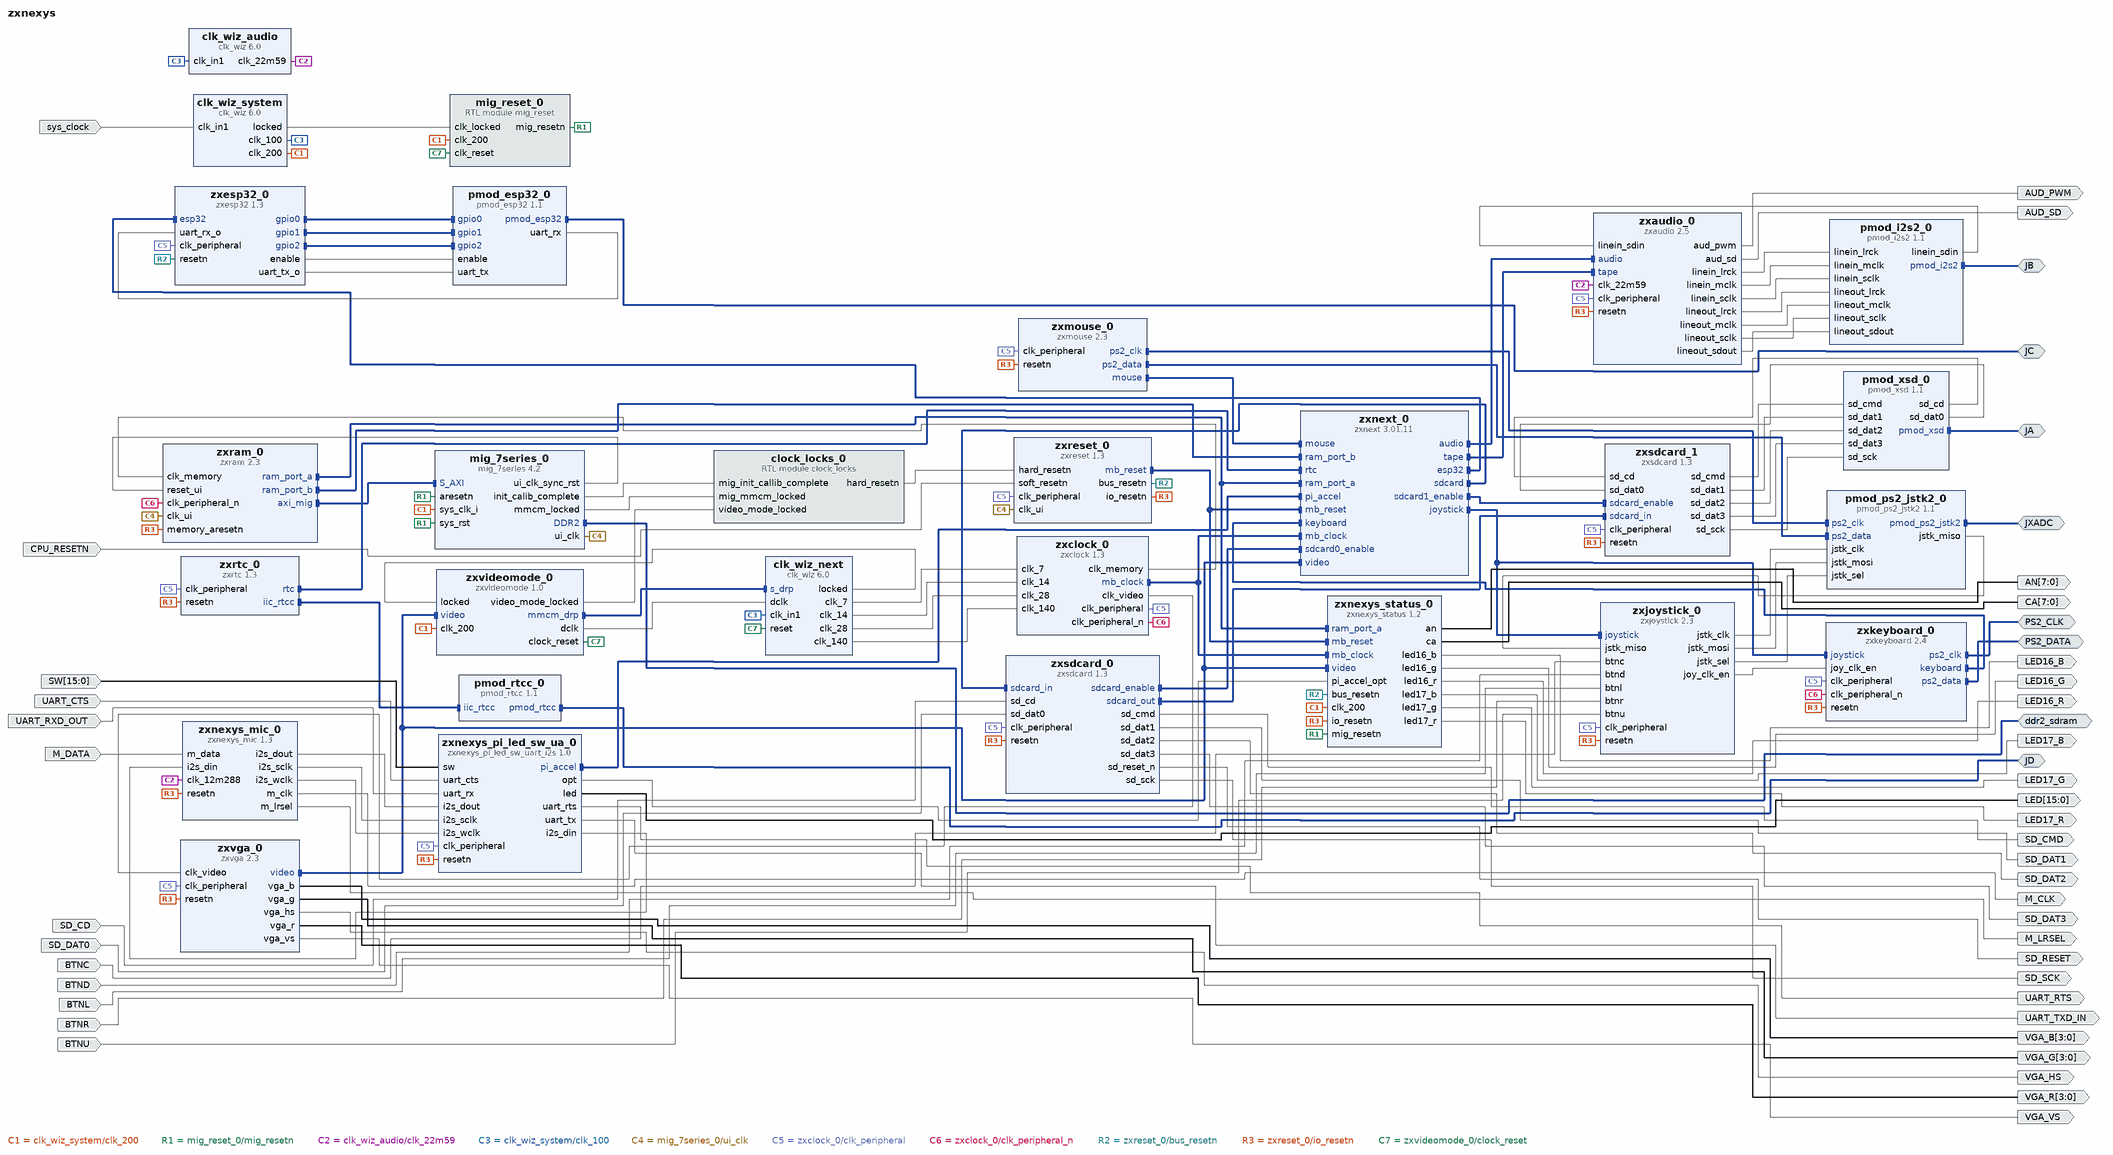
[diagram p0: block diagram of the top level]
# Vivado block design zxnexys, xc7a100tcsg324-1, Vivado 2021.2.1
create_bd_design zxnexys

create_bd_intf_port -mode Master -vlnv xilinx.com:interface:ddrx_rtl:1.0 ddr2_sdram
create_bd_intf_port -mode Master -vlnv digilentinc.com:interface:pmod_rtl:1.0 JC
create_bd_intf_port -mode Master -vlnv digilentinc.com:interface:pmod_rtl:1.0 JXADC
create_bd_intf_port -mode Master -vlnv digilentinc.com:interface:pmod_rtl:1.0 JD
create_bd_intf_port -mode Master -vlnv digilentinc.com:interface:pmod_rtl:1.0 JB
create_bd_intf_port -mode Master -vlnv digilentinc.com:interface:pmod_rtl:1.0 JA
create_bd_intf_port -mode Master -vlnv xilinx.com:interface:gpio_rtl:1.0 PS2_CLK
create_bd_intf_port -mode Master -vlnv xilinx.com:interface:gpio_rtl:1.0 PS2_DATA
create_bd_port -dir I -type clk sys_clock
set_property -dict {CONFIG.FREQ_HZ 100000000 CONFIG.PHASE 0.0} [get_bd_ports sys_clock]
create_bd_port -dir I -type rst CPU_RESETN
create_bd_port -dir I M_DATA
create_bd_port -dir O -type clk M_CLK
create_bd_port -dir O M_LRSEL
create_bd_port -dir O -from 7 -to 0 AN
create_bd_port -dir O -from 7 -to 0 CA
create_bd_port -dir O AUD_PWM
create_bd_port -dir O AUD_SD
create_bd_port -dir O -from 3 -to 0 VGA_B
create_bd_port -dir O -from 3 -to 0 VGA_G
create_bd_port -dir O -from 3 -to 0 VGA_R
create_bd_port -dir O VGA_HS
create_bd_port -dir O VGA_VS
create_bd_port -dir I SD_CD
create_bd_port -dir I SD_DAT0
create_bd_port -dir I BTNC
create_bd_port -dir I BTND
create_bd_port -dir I BTNL
create_bd_port -dir I BTNR
create_bd_port -dir I BTNU
create_bd_port -dir O SD_CMD
create_bd_port -dir O SD_DAT1
create_bd_port -dir O SD_DAT2
create_bd_port -dir O SD_DAT3
create_bd_port -dir O SD_RESET
create_bd_port -dir O SD_SCK
create_bd_port -dir O -from 15 -to 0 LED
create_bd_port -dir O LED16_B
create_bd_port -dir O LED16_G
create_bd_port -dir O LED16_R
create_bd_port -dir O LED17_B
create_bd_port -dir O LED17_G
create_bd_port -dir O LED17_R
create_bd_port -dir I -from 15 -to 0 SW
create_bd_port -dir O UART_RTS
create_bd_port -dir I UART_CTS
create_bd_port -dir O UART_TXD_IN
create_bd_port -dir I UART_RXD_OUT

create_bd_cell -type ip -vlnv xilinx.com:ip:clk_wiz:6.0 clk_wiz_next
set_property -dict [list \
  CONFIG.AXI_DRP false \
  CONFIG.CLKIN1_JITTER_PS 100.0 \
  CONFIG.CLKOUT1_DRIVES BUFG \
  CONFIG.CLKOUT1_JITTER 272.789 \
  CONFIG.CLKOUT1_PHASE_ERROR 310.955 \
  CONFIG.CLKOUT1_REQUESTED_OUT_FREQ 140 \
  CONFIG.CLKOUT1_REQUESTED_PHASE 0 \
  CONFIG.CLKOUT2_DRIVES No_buffer \
  CONFIG.CLKOUT2_JITTER 365.532 \
  CONFIG.CLKOUT2_PHASE_ERROR 310.955 \
  CONFIG.CLKOUT2_REQUESTED_OUT_FREQ 28 \
  CONFIG.CLKOUT2_REQUESTED_PHASE 0 \
  CONFIG.CLKOUT2_USED true \
  CONFIG.CLKOUT3_DRIVES No_buffer \
  CONFIG.CLKOUT3_JITTER 410.498 \
  CONFIG.CLKOUT3_PHASE_ERROR 310.955 \
  CONFIG.CLKOUT3_REQUESTED_OUT_FREQ 14 \
  CONFIG.CLKOUT3_REQUESTED_PHASE 0 \
  CONFIG.CLKOUT3_USED true \
  CONFIG.CLKOUT4_DRIVES No_buffer \
  CONFIG.CLKOUT4_JITTER 459.723 \
  CONFIG.CLKOUT4_PHASE_ERROR 310.955 \
  CONFIG.CLKOUT4_REQUESTED_OUT_FREQ 7 \
  CONFIG.CLKOUT4_REQUESTED_PHASE 0 \
  CONFIG.CLKOUT4_USED true \
  CONFIG.CLKOUT5_DRIVES No_buffer \
  CONFIG.CLKOUT5_JITTER 149.337 \
  CONFIG.CLKOUT5_PHASE_ERROR 122.577 \
  CONFIG.CLKOUT5_REQUESTED_OUT_FREQ 100 \
  CONFIG.CLKOUT5_REQUESTED_PHASE 0 \
  CONFIG.CLKOUT5_USED false \
  CONFIG.CLKOUT6_DRIVES No_buffer \
  CONFIG.CLKOUT6_JITTER 149.337 \
  CONFIG.CLKOUT6_PHASE_ERROR 122.577 \
  CONFIG.CLKOUT6_REQUESTED_OUT_FREQ 100 \
  CONFIG.CLKOUT6_REQUESTED_PHASE 0 \
  CONFIG.CLKOUT6_USED false \
  CONFIG.CLKOUT7_DRIVES No_buffer \
  CONFIG.CLKOUT7_JITTER 149.337 \
  CONFIG.CLKOUT7_PHASE_ERROR 122.577 \
  CONFIG.CLKOUT7_REQUESTED_OUT_FREQ 100 \
  CONFIG.CLKOUT7_REQUESTED_PHASE 0.000 \
  CONFIG.CLKOUT7_USED false \
  CONFIG.CLK_IN1_BOARD_INTERFACE Custom \
  CONFIG.CLK_OUT1_PORT clk_140 \
  CONFIG.CLK_OUT2_PORT clk_28 \
  CONFIG.CLK_OUT3_PORT clk_14 \
  CONFIG.CLK_OUT4_PORT clk_7 \
  CONFIG.CLK_OUT5_PORT clk_out5 \
  CONFIG.CLK_OUT6_PORT clk_out6 \
  CONFIG.CLK_OUT7_PORT clk_out7 \
  CONFIG.FEEDBACK_SOURCE FDBK_AUTO \
  CONFIG.INTERFACE_SELECTION Enable_DRP \
  CONFIG.MMCM_CLKFBOUT_MULT_F 42.000 \
  CONFIG.MMCM_CLKIN1_PERIOD 10.000 \
  CONFIG.MMCM_CLKIN2_PERIOD 10.000 \
  CONFIG.MMCM_CLKOUT0_DIVIDE_F 6.000 \
  CONFIG.MMCM_CLKOUT0_PHASE 0.000 \
  CONFIG.MMCM_CLKOUT1_DIVIDE 30 \
  CONFIG.MMCM_CLKOUT1_PHASE 0.000 \
  CONFIG.MMCM_CLKOUT2_DIVIDE 60 \
  CONFIG.MMCM_CLKOUT2_PHASE 0.000 \
  CONFIG.MMCM_CLKOUT3_DIVIDE 120 \
  CONFIG.MMCM_CLKOUT4_DIVIDE 1 \
  CONFIG.MMCM_CLKOUT4_PHASE 0.000 \
  CONFIG.MMCM_CLKOUT5_DIVIDE 1 \
  CONFIG.MMCM_CLKOUT6_DIVIDE 1 \
  CONFIG.MMCM_DIVCLK_DIVIDE 5 \
  CONFIG.NUM_OUT_CLKS 4 \
  CONFIG.OVERRIDE_MMCM false \
  CONFIG.PHASE_DUTY_CONFIG false \
  CONFIG.PRIM_SOURCE Global_buffer \
  CONFIG.RESET_PORT reset \
  CONFIG.RESET_TYPE ACTIVE_HIGH \
  CONFIG.USE_BOARD_FLOW true \
  CONFIG.USE_DYN_RECONFIG true \
  CONFIG.USE_RESET true \
] [get_bd_cells clk_wiz_next]
create_bd_cell -type ip -vlnv xilinx.com:ip:mig_7series:4.2 mig_7series_0
set_property -dict [list \
  CONFIG.BOARD_MIG_PARAM ddr2_sdram \
  CONFIG.MIG_DONT_TOUCH_PARAM Custom \
  CONFIG.RESET_BOARD_INTERFACE Custom \
  CONFIG.XML_INPUT_FILE mig_b.prj \
] [get_bd_cells mig_7series_0]
create_bd_cell -type ip -vlnv specnext.com:specnext:pmod_ps2_jstk2:1.1 pmod_ps2_jstk2_0
create_bd_cell -type ip -vlnv specnext.com:specnext:pmod_rtcc:1.1 pmod_rtcc_0
create_bd_cell -type ip -vlnv xilinx.com:ip:clk_wiz:6.0 clk_wiz_system
set_property -dict [list \
  CONFIG.CLKOUT1_DRIVES BUFG \
  CONFIG.CLKOUT1_JITTER 114.829 \
  CONFIG.CLKOUT1_PHASE_ERROR 98.575 \
  CONFIG.CLKOUT1_REQUESTED_OUT_FREQ 200 \
  CONFIG.CLKOUT2_DRIVES BUFG \
  CONFIG.CLKOUT2_JITTER 130.958 \
  CONFIG.CLKOUT2_PHASE_ERROR 98.575 \
  CONFIG.CLKOUT2_REQUESTED_OUT_FREQ 100 \
  CONFIG.CLKOUT2_USED true \
  CONFIG.CLKOUT3_DRIVES BUFG \
  CONFIG.CLKOUT3_JITTER 149.337 \
  CONFIG.CLKOUT3_PHASE_ERROR 122.577 \
  CONFIG.CLKOUT3_REQUESTED_OUT_FREQ 100.000 \
  CONFIG.CLKOUT3_USED false \
  CONFIG.CLK_IN1_BOARD_INTERFACE sys_clock \
  CONFIG.CLK_OUT1_PORT clk_200 \
  CONFIG.CLK_OUT2_PORT clk_100 \
  CONFIG.CLK_OUT3_PORT clk_out3 \
  CONFIG.FEEDBACK_SOURCE FDBK_AUTO \
  CONFIG.MMCM_CLKFBOUT_MULT_F 10.000 \
  CONFIG.MMCM_CLKOUT0_DIVIDE_F 5.000 \
  CONFIG.MMCM_CLKOUT1_DIVIDE 10 \
  CONFIG.MMCM_CLKOUT2_DIVIDE 1 \
  CONFIG.NUM_OUT_CLKS 2 \
  CONFIG.OVERRIDE_MMCM false \
  CONFIG.USE_RESET false \
] [get_bd_cells clk_wiz_system]
create_bd_cell -type ip -vlnv specnext.com:specnext:zxclock:1.3 zxclock_0
create_bd_cell -type ip -vlnv xilinx.com:ip:clk_wiz:6.0 clk_wiz_audio
set_property -dict [list \
  CONFIG.CLKOUT1_JITTER 420.831 \
  CONFIG.CLKOUT1_PHASE_ERROR 380.190 \
  CONFIG.CLKOUT1_REQUESTED_OUT_FREQ 22.59001 \
  CONFIG.CLK_OUT1_PORT clk_22m59 \
  CONFIG.MMCM_CLKFBOUT_MULT_F 48.625 \
  CONFIG.MMCM_CLKOUT0_DIVIDE_F 35.875 \
  CONFIG.MMCM_DIVCLK_DIVIDE 6 \
  CONFIG.PRIM_SOURCE Global_buffer \
  CONFIG.USE_LOCKED false \
  CONFIG.USE_RESET false \
] [get_bd_cells clk_wiz_audio]
create_bd_cell -type ip -vlnv specnext.com:specnext:pmod_xsd:1.1 pmod_xsd_0
create_bd_cell -type ip -vlnv specnext.com:specnext:pmod_i2s2:1.1 pmod_i2s2_0
create_bd_cell -type module -reference clock_locks clock_locks_0
create_bd_cell -type module -reference mig_reset mig_reset_0
create_bd_cell -type ip -vlnv specnext.com:specnext:zxnext:3.01.11 zxnext_0
create_bd_cell -type ip -vlnv specnext.com:specnext:zxram:2.3 zxram_0
create_bd_cell -type ip -vlnv specnext.com:specnext:zxvga:2.3 zxvga_0
create_bd_cell -type ip -vlnv specnext.com:specnext:zxvideomode:1.0 zxvideomode_0
create_bd_cell -type ip -vlnv specnext.com:specnext:pmod_esp32:1.1 pmod_esp32_0
create_bd_cell -type ip -vlnv specnext.com:specnext:zxaudio:2.5 zxaudio_0
set_property -dict {CONFIG.i2s2_in true CONFIG.mono_tape 0} [get_bd_cells zxaudio_0]
create_bd_cell -type ip -vlnv specnext.com:specnext:zxesp32:1.3 zxesp32_0
create_bd_cell -type ip -vlnv specnext.com:specnext:zxjoystick:2.3 zxjoystick_0
create_bd_cell -type ip -vlnv specnext.com:specnext:zxmouse:2.3 zxmouse_0
create_bd_cell -type ip -vlnv specnext.com:specnext:zxnexys_pi_led_sw_uart_i2s:1.0 zxnexys_pi_led_sw_ua_0
create_bd_cell -type ip -vlnv specnext.com:specnext:zxsdcard:1.3 zxsdcard_0
create_bd_cell -type ip -vlnv specnext.com:specnext:zxsdcard:1.3 zxsdcard_1
set_property -dict {CONFIG.MicroSD true CONFIG.Terminated true} [get_bd_cells zxsdcard_1]
create_bd_cell -type ip -vlnv specnext.com:specnext:zxkeyboard:2.4 zxkeyboard_0
create_bd_cell -type ip -vlnv specnext.com:specnext:zxnexys_mic:1.3 zxnexys_mic_0
create_bd_cell -type ip -vlnv specnext.com:specnext:zxrtc:1.3 zxrtc_0
create_bd_cell -type ip -vlnv specnext.com:specnext:zxreset:1.3 zxreset_0
set_property -dict {CONFIG.IO_RESET_HOLD 20 CONFIG.MB_RESET_HOLD 22} [get_bd_cells zxreset_0]
create_bd_cell -type ip -vlnv specnext.com:specnext:zxnexys_status:1.2 zxnexys_status_0
set_property -dict {CONFIG.PI_ACCEL_CONFIG true} [get_bd_cells zxnexys_status_0]

# ---- connections ----

connect_bd_intf_net [get_bd_intf_ports ddr2_sdram] [get_bd_intf_pins mig_7series_0/DDR2]
connect_bd_intf_net [get_bd_intf_ports JC] [get_bd_intf_pins pmod_esp32_0/pmod_esp32]
connect_bd_intf_net [get_bd_intf_ports JB] [get_bd_intf_pins pmod_i2s2_0/pmod_i2s2]
connect_bd_intf_net [get_bd_intf_ports JXADC] [get_bd_intf_pins pmod_ps2_jstk2_0/pmod_ps2_jstk2]
connect_bd_intf_net [get_bd_intf_ports JD] [get_bd_intf_pins pmod_rtcc_0/pmod_rtcc]
connect_bd_intf_net [get_bd_intf_ports JA] [get_bd_intf_pins pmod_xsd_0/pmod_xsd]
connect_bd_intf_net [get_bd_intf_pins zxclock_0/mb_clock] [get_bd_intf_pins zxnext_0/mb_clock]
connect_bd_intf_net [get_bd_intf_pins zxclock_0/mb_clock] [get_bd_intf_pins zxnexys_status_0/mb_clock]
connect_bd_intf_net [get_bd_intf_pins zxesp32_0/gpio0] [get_bd_intf_pins pmod_esp32_0/gpio0]
connect_bd_intf_net [get_bd_intf_pins zxesp32_0/gpio1] [get_bd_intf_pins pmod_esp32_0/gpio1]
connect_bd_intf_net [get_bd_intf_pins zxesp32_0/gpio2] [get_bd_intf_pins pmod_esp32_0/gpio2]
connect_bd_intf_net [get_bd_intf_ports PS2_CLK] [get_bd_intf_pins zxkeyboard_0/ps2_clk]
connect_bd_intf_net [get_bd_intf_ports PS2_DATA] [get_bd_intf_pins zxkeyboard_0/ps2_data]
connect_bd_intf_net [get_bd_intf_pins zxmouse_0/ps2_clk] [get_bd_intf_pins pmod_ps2_jstk2_0/ps2_clk]
connect_bd_intf_net [get_bd_intf_pins zxmouse_0/ps2_data] [get_bd_intf_pins pmod_ps2_jstk2_0/ps2_data]
connect_bd_intf_net [get_bd_intf_pins zxnext_0/audio] [get_bd_intf_pins zxaudio_0/audio]
connect_bd_intf_net [get_bd_intf_pins zxnext_0/esp32] [get_bd_intf_pins zxesp32_0/esp32]
connect_bd_intf_net [get_bd_intf_pins zxnext_0/joystick] [get_bd_intf_pins zxjoystick_0/joystick]
connect_bd_intf_net [get_bd_intf_pins zxnext_0/joystick] [get_bd_intf_pins zxkeyboard_0/joystick]
connect_bd_intf_net [get_bd_intf_pins zxkeyboard_0/keyboard] [get_bd_intf_pins zxnext_0/keyboard]
connect_bd_intf_net [get_bd_intf_pins zxmouse_0/mouse] [get_bd_intf_pins zxnext_0/mouse]
connect_bd_intf_net [get_bd_intf_pins zxnexys_pi_led_sw_ua_0/pi_accel] [get_bd_intf_pins zxnext_0/pi_accel]
connect_bd_intf_net [get_bd_intf_pins zxram_0/ram_port_a] [get_bd_intf_pins zxnext_0/ram_port_a]
connect_bd_intf_net [get_bd_intf_pins zxram_0/ram_port_a] [get_bd_intf_pins zxnexys_status_0/ram_port_a]
connect_bd_intf_net [get_bd_intf_pins zxram_0/ram_port_b] [get_bd_intf_pins zxnext_0/ram_port_b]
connect_bd_intf_net [get_bd_intf_pins zxrtc_0/rtc] [get_bd_intf_pins zxnext_0/rtc]
connect_bd_intf_net [get_bd_intf_pins zxsdcard_0/sdcard_in] [get_bd_intf_pins zxnext_0/sdcard]
connect_bd_intf_net [get_bd_intf_pins zxsdcard_0/sdcard_enable] [get_bd_intf_pins zxnext_0/sdcard0_enable]
connect_bd_intf_net [get_bd_intf_pins zxnext_0/sdcard1_enable] [get_bd_intf_pins zxsdcard_1/sdcard_enable]
connect_bd_intf_net [get_bd_intf_pins zxnext_0/tape] [get_bd_intf_pins zxaudio_0/tape]
connect_bd_intf_net [get_bd_intf_pins zxvga_0/video] [get_bd_intf_pins zxnext_0/video]
connect_bd_intf_net [get_bd_intf_pins zxvga_0/video] [get_bd_intf_pins zxvideomode_0/video]
connect_bd_intf_net [get_bd_intf_pins zxvga_0/video] [get_bd_intf_pins zxnexys_status_0/video]
connect_bd_intf_net [get_bd_intf_pins zxram_0/axi_mig] [get_bd_intf_pins mig_7series_0/S_AXI]
connect_bd_intf_net [get_bd_intf_pins zxreset_0/mb_reset] [get_bd_intf_pins zxnext_0/mb_reset]
connect_bd_intf_net [get_bd_intf_pins zxreset_0/mb_reset] [get_bd_intf_pins zxnexys_status_0/mb_reset]
connect_bd_intf_net [get_bd_intf_pins zxrtc_0/iic_rtcc] [get_bd_intf_pins pmod_rtcc_0/iic_rtcc]
connect_bd_intf_net [get_bd_intf_pins zxsdcard_1/sdcard_in] [get_bd_intf_pins zxsdcard_0/sdcard_out]
connect_bd_intf_net [get_bd_intf_pins zxvideomode_0/mmcm_drp] [get_bd_intf_pins clk_wiz_next/s_drp]
connect_bd_net [get_bd_ports CPU_RESETN] [get_bd_pins zxreset_0/soft_resetn]
connect_bd_net [get_bd_ports M_DATA] [get_bd_pins zxnexys_mic_0/m_data]
connect_bd_net [get_bd_ports SD_CD] [get_bd_pins zxsdcard_0/sd_cd]
connect_bd_net -net SD_DAT0_1 [get_bd_ports SD_DAT0] [get_bd_pins zxsdcard_0/sd_dat0]
connect_bd_net [get_bd_ports SW] [get_bd_pins zxnexys_pi_led_sw_ua_0/sw]
connect_bd_net [get_bd_ports UART_CTS] [get_bd_pins zxnexys_pi_led_sw_ua_0/uart_cts]
connect_bd_net -net UART_TXD_IN_1 [get_bd_ports UART_RXD_OUT] [get_bd_pins zxnexys_pi_led_sw_ua_0/uart_rx]
connect_bd_net -net btnc_0_1 [get_bd_ports BTNC] [get_bd_pins zxjoystick_0/btnc]
connect_bd_net -net btnd_0_1 [get_bd_ports BTND] [get_bd_pins zxjoystick_0/btnd]
connect_bd_net -net btnl_0_1 [get_bd_ports BTNL] [get_bd_pins zxjoystick_0/btnl]
connect_bd_net -net btnr_0_1 [get_bd_ports BTNR] [get_bd_pins zxjoystick_0/btnr]
connect_bd_net -net btnu_0_1 [get_bd_ports BTNU] [get_bd_pins zxjoystick_0/btnu]
connect_bd_net -net clk_wiz_0_clk_7 [get_bd_pins clk_wiz_next/clk_7] [get_bd_pins zxclock_0/clk_7]
connect_bd_net -net clk_wiz_0_clk_14 [get_bd_pins clk_wiz_next/clk_14] [get_bd_pins zxclock_0/clk_14]
connect_bd_net -net clk_wiz_0_clk_28 [get_bd_pins clk_wiz_next/clk_28] [get_bd_pins zxclock_0/clk_28]
connect_bd_net -net clk_wiz_0_clk_140 [get_bd_pins clk_wiz_next/clk_140] [get_bd_pins zxclock_0/clk_140]
connect_bd_net -net clk_wiz_1_clk_200 [get_bd_pins clk_wiz_system/clk_200] \
  [get_bd_pins mig_7series_0/sys_clk_i] [get_bd_pins mig_reset_0/clk_200] [get_bd_pins zxvideomode_0/clk_200] \
  [get_bd_pins zxnexys_status_0/clk_200]
connect_bd_net -net clk_wiz_1_locked [get_bd_pins mig_reset_0/mig_resetn] \
  [get_bd_pins mig_7series_0/sys_rst] [get_bd_pins mig_7series_0/aresetn] [get_bd_pins zxnexys_status_0/mig_resetn]
connect_bd_net [get_bd_pins clk_wiz_audio/clk_22m59] [get_bd_pins zxaudio_0/clk_22m59] [get_bd_pins zxnexys_mic_0/clk_12m288]
connect_bd_net [get_bd_pins clk_wiz_next/locked] [get_bd_pins zxvideomode_0/locked]
connect_bd_net [get_bd_pins clk_wiz_system/clk_100] [get_bd_pins clk_wiz_next/clk_in1] [get_bd_pins clk_wiz_audio/clk_in1]
connect_bd_net [get_bd_pins clk_wiz_system/locked] [get_bd_pins mig_reset_0/clk_locked]
connect_bd_net [get_bd_pins clock_locks_0/hard_resetn] [get_bd_pins zxreset_0/hard_resetn]
connect_bd_net [get_bd_pins mig_7series_0/init_calib_complete] [get_bd_pins clock_locks_0/mig_init_callib_complete]
connect_bd_net [get_bd_pins mig_7series_0/mmcm_locked] [get_bd_pins clock_locks_0/mig_mmcm_locked]
connect_bd_net [get_bd_pins mig_7series_0/ui_clk] [get_bd_pins zxram_0/clk_ui] [get_bd_pins zxreset_0/clk_ui]
connect_bd_net [get_bd_pins mig_7series_0/ui_clk_sync_rst] [get_bd_pins zxram_0/reset_ui]
connect_bd_net [get_bd_pins pmod_esp32_0/uart_rx] [get_bd_pins zxesp32_0/uart_rx_o]
connect_bd_net [get_bd_pins pmod_i2s2_0/linein_sdin] [get_bd_pins zxaudio_0/linein_sdin]
connect_bd_net [get_bd_pins pmod_ps2_jstk2_0/jstk_miso] [get_bd_pins zxjoystick_0/jstk_miso]
connect_bd_net [get_bd_pins pmod_xsd_0/sd_cd] [get_bd_pins zxsdcard_1/sd_cd]
connect_bd_net [get_bd_pins pmod_xsd_0/sd_dat0] [get_bd_pins zxsdcard_1/sd_dat0]
connect_bd_net [get_bd_ports sys_clock] [get_bd_pins clk_wiz_system/clk_in1]
connect_bd_net [get_bd_pins zxaudio_0/aud_pwm] [get_bd_ports AUD_PWM]
connect_bd_net [get_bd_pins zxaudio_0/linein_lrck] [get_bd_pins pmod_i2s2_0/linein_lrck]
connect_bd_net [get_bd_pins zxaudio_0/linein_mclk] [get_bd_pins pmod_i2s2_0/linein_mclk]
connect_bd_net [get_bd_pins zxaudio_0/linein_sclk] [get_bd_pins pmod_i2s2_0/linein_sclk]
connect_bd_net [get_bd_pins zxaudio_0/lineout_lrck] [get_bd_pins pmod_i2s2_0/lineout_lrck]
connect_bd_net [get_bd_pins zxaudio_0/lineout_mclk] [get_bd_pins pmod_i2s2_0/lineout_mclk]
connect_bd_net [get_bd_pins zxaudio_0/lineout_sclk] [get_bd_pins pmod_i2s2_0/lineout_sclk]
connect_bd_net [get_bd_pins zxaudio_0/lineout_sdout] [get_bd_pins pmod_i2s2_0/lineout_sdout]
connect_bd_net -net zxaudio_0_tape_sd [get_bd_pins zxaudio_0/aud_sd] [get_bd_ports AUD_SD]
connect_bd_net [get_bd_pins zxclock_0/clk_memory] [get_bd_pins zxram_0/clk_memory]
connect_bd_net [get_bd_pins zxclock_0/clk_peripheral] \
  [get_bd_pins zxvga_0/clk_peripheral] [get_bd_pins zxaudio_0/clk_peripheral] [get_bd_pins zxesp32_0/clk_peripheral] \
  [get_bd_pins zxjoystick_0/clk_peripheral] [get_bd_pins zxmouse_0/clk_peripheral] \
  [get_bd_pins zxnexys_pi_led_sw_ua_0/clk_peripheral] [get_bd_pins zxsdcard_0/clk_peripheral] \
  [get_bd_pins zxsdcard_1/clk_peripheral] [get_bd_pins zxkeyboard_0/clk_peripheral] [get_bd_pins zxrtc_0/clk_peripheral] \
  [get_bd_pins zxreset_0/clk_peripheral]
connect_bd_net [get_bd_pins zxclock_0/clk_peripheral_n] [get_bd_pins zxram_0/clk_peripheral_n] [get_bd_pins zxkeyboard_0/clk_peripheral_n]
connect_bd_net [get_bd_pins zxclock_0/clk_video] [get_bd_pins zxvga_0/clk_video]
connect_bd_net [get_bd_pins zxesp32_0/enable] [get_bd_pins pmod_esp32_0/enable]
connect_bd_net [get_bd_pins zxesp32_0/uart_tx_o] [get_bd_pins pmod_esp32_0/uart_tx]
connect_bd_net [get_bd_pins zxjoystick_0/joy_clk_en] [get_bd_pins zxkeyboard_0/joy_clk_en]
connect_bd_net [get_bd_pins zxjoystick_0/jstk_clk] [get_bd_pins pmod_ps2_jstk2_0/jstk_clk]
connect_bd_net [get_bd_pins zxjoystick_0/jstk_mosi] [get_bd_pins pmod_ps2_jstk2_0/jstk_mosi]
connect_bd_net [get_bd_pins zxjoystick_0/jstk_sel] [get_bd_pins pmod_ps2_jstk2_0/jstk_sel]
connect_bd_net [get_bd_pins zxnexys_mic_0/i2s_dout] [get_bd_pins zxnexys_pi_led_sw_ua_0/i2s_dout]
connect_bd_net [get_bd_pins zxnexys_mic_0/i2s_sclk] [get_bd_pins zxnexys_pi_led_sw_ua_0/i2s_sclk]
connect_bd_net [get_bd_pins zxnexys_mic_0/i2s_wclk] [get_bd_pins zxnexys_pi_led_sw_ua_0/i2s_wclk]
connect_bd_net [get_bd_pins zxnexys_mic_0/m_clk] [get_bd_ports M_CLK]
connect_bd_net [get_bd_pins zxnexys_mic_0/m_lrsel] [get_bd_ports M_LRSEL]
connect_bd_net [get_bd_pins zxnexys_pi_led_sw_ua_0/i2s_din] [get_bd_pins zxnexys_mic_0/i2s_din]
connect_bd_net [get_bd_pins zxnexys_pi_led_sw_ua_0/led] [get_bd_ports LED]
connect_bd_net [get_bd_pins zxnexys_pi_led_sw_ua_0/opt] [get_bd_pins zxnexys_status_0/pi_accel_opt]
connect_bd_net [get_bd_pins zxnexys_pi_led_sw_ua_0/uart_rts] [get_bd_ports UART_RTS]
connect_bd_net [get_bd_pins zxnexys_pi_led_sw_ua_0/uart_tx] [get_bd_ports UART_TXD_IN]
connect_bd_net [get_bd_pins zxnexys_status_0/an] [get_bd_ports AN]
connect_bd_net [get_bd_pins zxnexys_status_0/ca] [get_bd_ports CA]
connect_bd_net [get_bd_pins zxnexys_status_0/led16_b] [get_bd_ports LED16_B]
connect_bd_net [get_bd_pins zxnexys_status_0/led16_g] [get_bd_ports LED16_G]
connect_bd_net [get_bd_pins zxnexys_status_0/led16_r] [get_bd_ports LED16_R]
connect_bd_net [get_bd_pins zxnexys_status_0/led17_b] [get_bd_ports LED17_B]
connect_bd_net [get_bd_pins zxnexys_status_0/led17_g] [get_bd_ports LED17_G]
connect_bd_net [get_bd_pins zxnexys_status_0/led17_r] [get_bd_ports LED17_R]
connect_bd_net [get_bd_pins zxreset_0/bus_resetn] [get_bd_pins zxesp32_0/resetn] [get_bd_pins zxnexys_status_0/bus_resetn]
connect_bd_net -net zxreset_0_mb_resetn [get_bd_pins zxreset_0/io_resetn] \
  [get_bd_pins zxram_0/memory_aresetn] [get_bd_pins zxvga_0/resetn] [get_bd_pins zxjoystick_0/resetn] \
  [get_bd_pins zxmouse_0/resetn] [get_bd_pins zxsdcard_0/resetn] [get_bd_pins zxnexys_pi_led_sw_ua_0/resetn] \
  [get_bd_pins zxaudio_0/resetn] [get_bd_pins zxsdcard_1/resetn] [get_bd_pins zxkeyboard_0/resetn] \
  [get_bd_pins zxnexys_mic_0/resetn] [get_bd_pins zxrtc_0/resetn] [get_bd_pins zxnexys_status_0/io_resetn]
connect_bd_net [get_bd_pins zxsdcard_0/sd_cmd] [get_bd_ports SD_CMD]
connect_bd_net [get_bd_pins zxsdcard_0/sd_dat1] [get_bd_ports SD_DAT1]
connect_bd_net [get_bd_pins zxsdcard_0/sd_dat2] [get_bd_ports SD_DAT2]
connect_bd_net [get_bd_pins zxsdcard_0/sd_dat3] [get_bd_ports SD_DAT3]
connect_bd_net [get_bd_pins zxsdcard_0/sd_reset_n] [get_bd_ports SD_RESET]
connect_bd_net [get_bd_pins zxsdcard_0/sd_sck] [get_bd_ports SD_SCK]
connect_bd_net [get_bd_pins zxsdcard_1/sd_cmd] [get_bd_pins pmod_xsd_0/sd_cmd]
connect_bd_net [get_bd_pins zxsdcard_1/sd_dat1] [get_bd_pins pmod_xsd_0/sd_dat1]
connect_bd_net [get_bd_pins zxsdcard_1/sd_dat2] [get_bd_pins pmod_xsd_0/sd_dat2]
connect_bd_net [get_bd_pins zxsdcard_1/sd_dat3] [get_bd_pins pmod_xsd_0/sd_dat3]
connect_bd_net [get_bd_pins zxsdcard_1/sd_sck] [get_bd_pins pmod_xsd_0/sd_sck]
connect_bd_net [get_bd_pins zxvga_0/vga_b] [get_bd_ports VGA_B]
connect_bd_net [get_bd_pins zxvga_0/vga_g] [get_bd_ports VGA_G]
connect_bd_net [get_bd_pins zxvga_0/vga_hs] [get_bd_ports VGA_HS]
connect_bd_net [get_bd_pins zxvga_0/vga_r] [get_bd_ports VGA_R]
connect_bd_net [get_bd_pins zxvga_0/vga_vs] [get_bd_ports VGA_VS]
connect_bd_net [get_bd_pins zxvideomode_0/clock_reset] [get_bd_pins clk_wiz_next/reset] [get_bd_pins mig_reset_0/clk_reset]
connect_bd_net [get_bd_pins zxvideomode_0/dclk] [get_bd_pins clk_wiz_next/dclk]
connect_bd_net [get_bd_pins zxvideomode_0/video_mode_locked] [get_bd_pins clock_locks_0/video_mode_locked]

# ---- address map ----
assign_bd_address -offset 0x0000000 -range 128M -target_address_space [get_bd_addr_spaces zxram_0/axi_mig] [get_bd_addr_segs mig_7series_0/memmap/memaddr]

validate_bd_design
save_bd_design
